# Altium schematic sheet 03_Power_Analog_Part.SchDoc
size A3; SheetNumber: 3; SheetTotal: 6
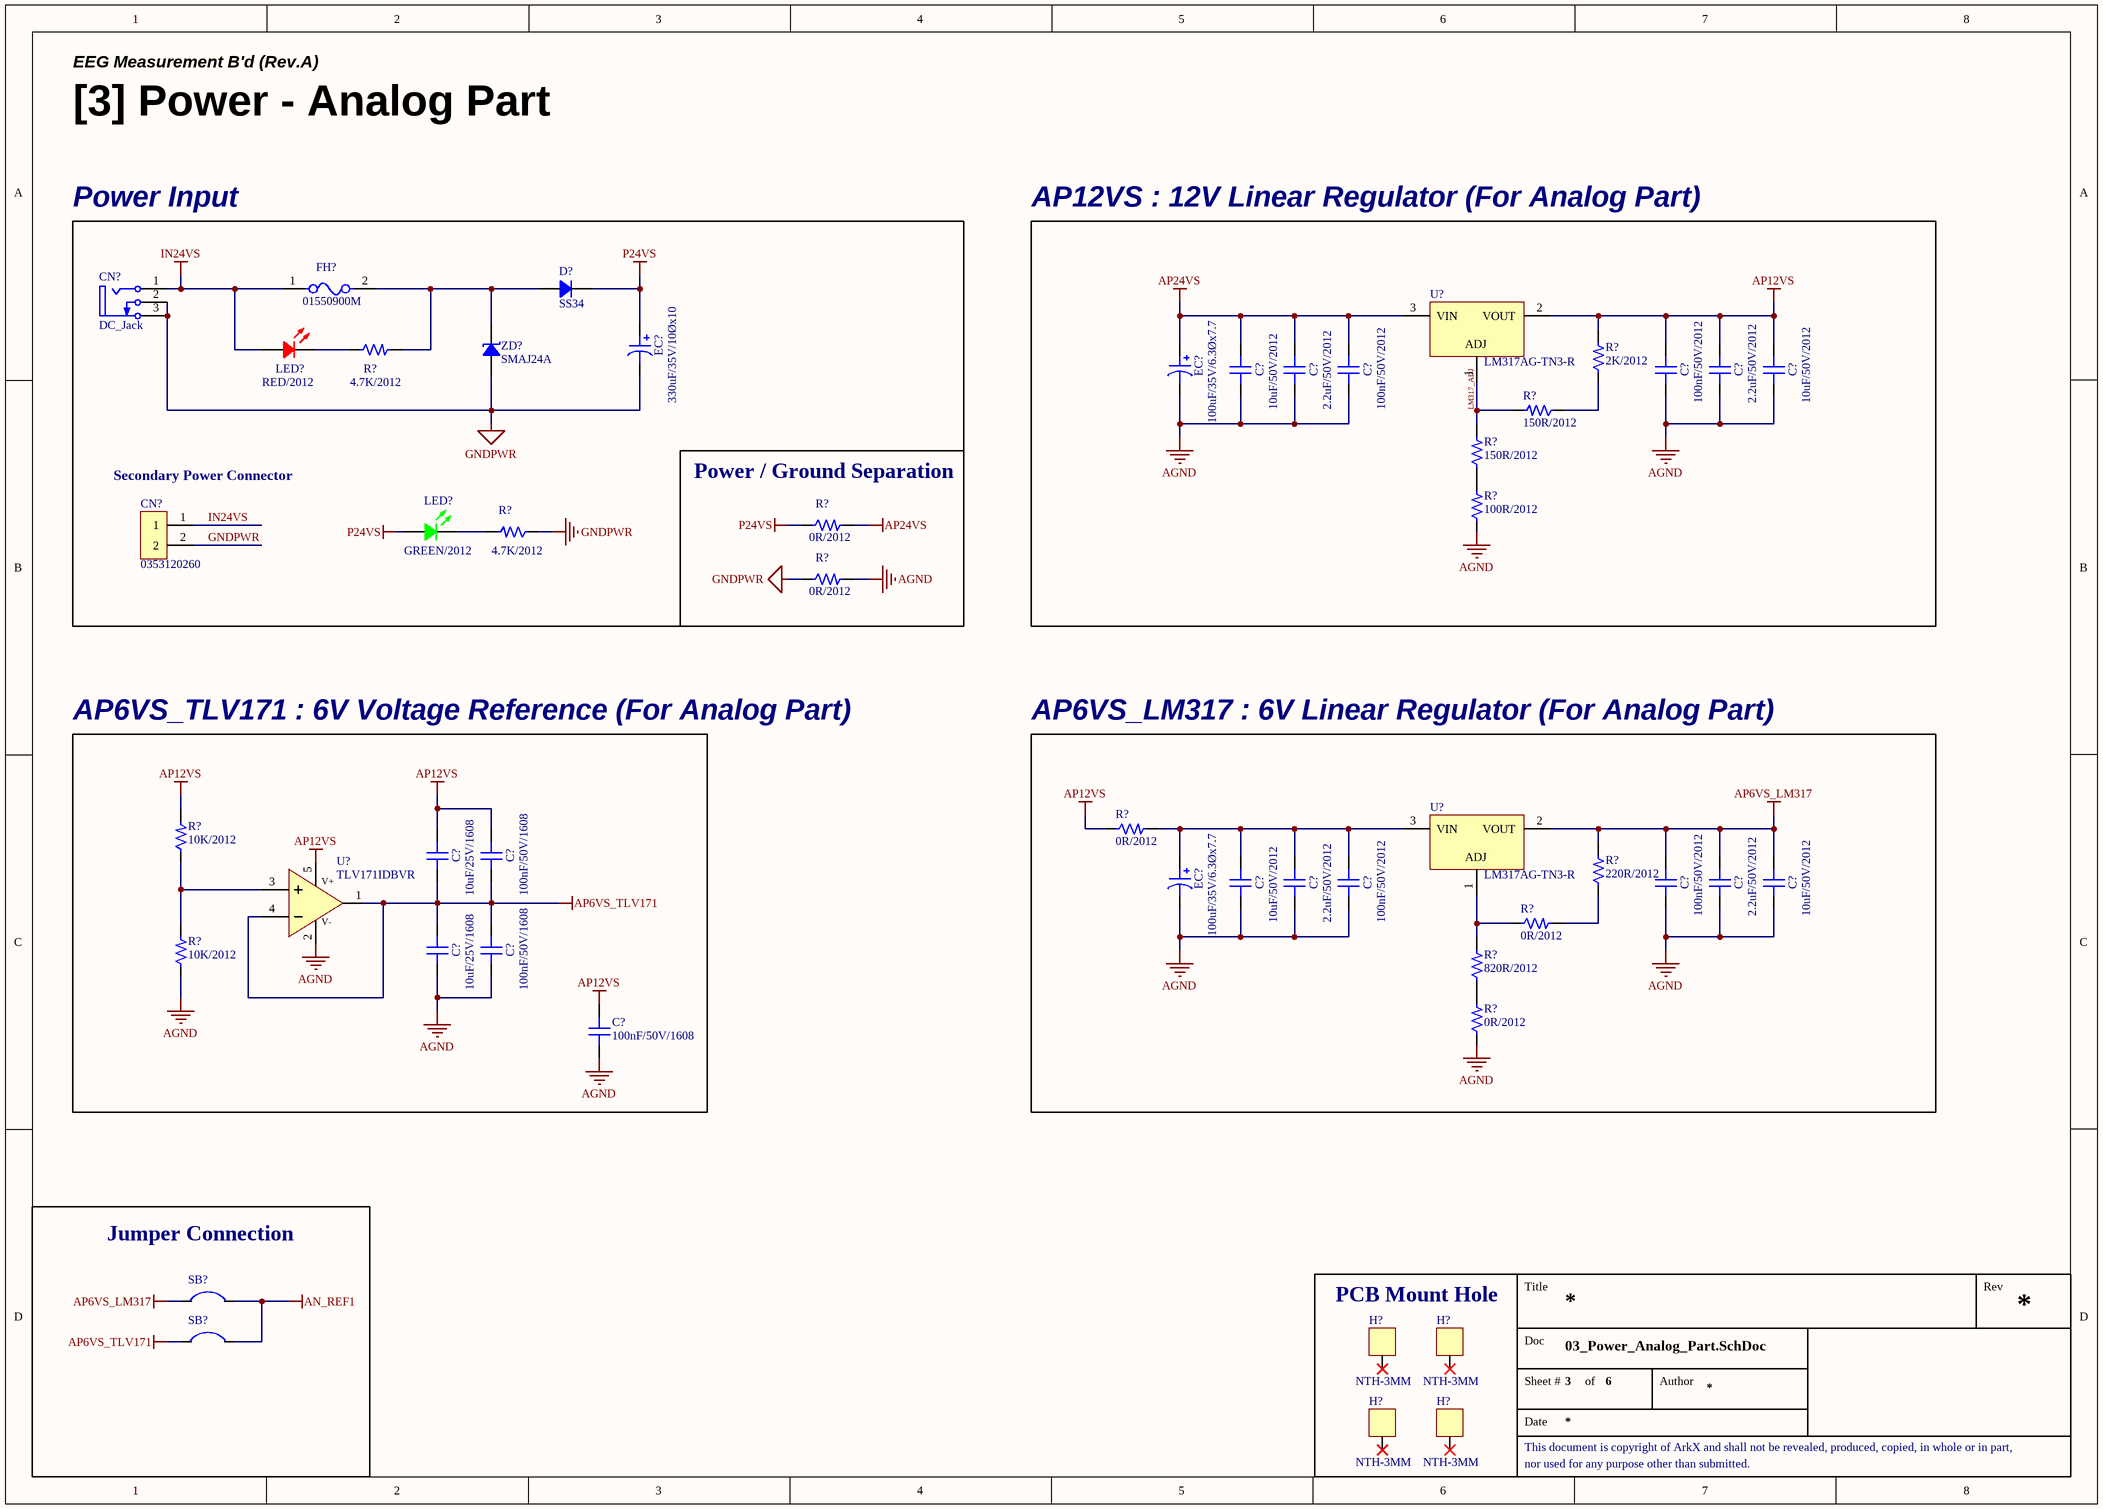
[diagram p0: 03_Power_Analog_Part.SchDoc]

## Parts
(Parts that share a designator on the sheet are numbered #1, #2 ... from top to bottom, then left to right.)
C?#1  10uF/50V/2012  [CAP 2012 (0805_INCH)]
C?#2  2.2uF/50V/2012  [CAP 2012 (0805_INCH)]
C?#3  100nF/50V/2012  [CAP 2012 (0805_INCH)]
C?#4  100nF/50V/2012  [CAP 2012 (0805_INCH)]
C?#5  2.2uF/50V/2012  [CAP 2012 (0805_INCH)]
C?#6  10uF/50V/2012  [CAP 2012 (0805_INCH)]
C?#7  10uF/25V/1608  [CAP 1608 (0603_INCH)]
C?#8  100nF/50V/1608  [CAP 1608 (0603_INCH)]
C?#9  10uF/50V/2012  [CAP 2012 (0805_INCH)]
C?#10  2.2uF/50V/2012  [CAP 2012 (0805_INCH)]
C?#11  100nF/50V/2012  [CAP 2012 (0805_INCH)]
C?#12  100nF/50V/2012  [CAP 2012 (0805_INCH)]
C?#13  2.2uF/50V/2012  [CAP 2012 (0805_INCH)]
C?#14  10uF/50V/2012  [CAP 2012 (0805_INCH)]
C?#15  10uF/25V/1608  [CAP 1608 (0603_INCH)]
C?#16  100nF/50V/1608  [CAP 1608 (0603_INCH)]
C?#17  100nF/50V/1608  [CAP 1608 (0603_INCH)]
CN?#1  DC_Jack  [CON DC-Jack]
CN?#2  0353120260  [CON 0353120260 (MOLEX)]
D?  SS34  [DIO DO-214AC (SMA)]
EC?#1  330uF/35V/10Øx10  [CAP ALSMD 10.3MM H10.5MM LEADSPANMAX12MM]
EC?#2  100uF/35V/6.3Øx7.7  [CAP ALSMD 6.6MM H7.7MM]
EC?#3  100uF/35V/6.3Øx7.7  [CAP ALSMD 6.6MM H7.7MM]
FH?  01550900M  [FUSE 01550900M_SMD(Hand_Solder)]
H?#1  NTH-3MM  [HOLE NTH-3MM]
H?#2  NTH-3MM  [HOLE NTH-3MM]
H?#3  NTH-3MM  [HOLE NTH-3MM]
H?#4  NTH-3MM  [HOLE NTH-3MM]
LED?#1  RED/2012  [LED MHT170RGBCT (RED)]
LED?#2  GREEN/2012  [LED MHT170RGBCT (GREEN)]
R?#1  4.7K/2012  [RES 2012 (0805_inch)]
R?#2  2K/2012  [RES 2012 (0805_inch)]
R?#3  150R/2012  [RES 2012 (0805_inch)]
R?#4  150R/2012  [RES 2012 (0805_inch)]
R?#5  100R/2012  [RES 2012 (0805_inch)]
R?#6  0R/2012  [RES 2012 (0805_inch)]
R?#7  4.7K/2012  [RES 2012 (0805_inch)]
R?#8  0R/2012  [RES 2012 (0805_inch)]
R?#9  0R/2012  [RES 2012 (0805_inch)]
R?#10  10K/2012  [RES 2012 (0805_inch)]
R?#11  220R/2012  [RES 2012 (0805_inch)]
R?#12  0R/2012  [RES 2012 (0805_inch)]
R?#13  10K/2012  [RES 2012 (0805_inch)]
R?#14  820R/2012  [RES 2012 (0805_inch)]
R?#15  0R/2012  [RES 2012 (0805_inch)]
SB?#1  SB  [SB (Solder-Bridge)]  (value not drawn)
SB?#2  SB  [SB (Solder-Bridge)]  (value not drawn)
U?#1  LM317AG-TN3-R
U?#2  LM317AG-TN3-R
U?#3  TLV171IDBVR  [SOT-23-5 (TI DBV PACKAGE)]
ZD?  SMAJ24A  [DIO DO-214AC (SMA)]

## Blocks framed on the sheet
Power Input: CN?#1 CN?#2 D? EC?#1 FH? LED?#1 LED?#2 R?#1 R?#7 ZD?
AP12VS : 12V Linear Regulator (For Analog Part): C?#1-C?#6 EC?#2 R?#2-R?#5 U?#1
Power / Ground Separation: R?#6 R?#8
AP6VS_TLV171 : 6V Voltage Reference (For Analog Part): C?#7 C?#8 C?#15-C?#17 R?#10 R?#13 U?#3
AP6VS_LM317 : 6V Linear Regulator (For Analog Part): C?#9-C?#14 EC?#3 R?#9 R?#11 R?#12 R?#14 R?#15 U?#2
Jumper Connection: SB?#1 SB?#2
PCB Mount Hole: H?#1-H?#4

## Nets
AGND: C?#1.1 C?#2.1 C?#3.1 C?#4.1 C?#5.1 C?#6.1 C?#9.1 C?#10.1 C?#11.1 C?#12.1 C?#13.1 C?#14.1 C?#15.1 C?#16.1 C?#17.1 EC?#2.2 EC?#3.2 R?#5.1 R?#8.2 R?#13.1 R?#15.1 U?#3.2(V-)
AN_REF1: SB?#1.1 SB?#2.1
AP6VS_LM317: C?#12.2 C?#13.2 C?#14.2 R?#11.2 SB?#1.2 U?#2.2(VOUT)
AP6VS_TLV171: C?#7.1 C?#8.1 C?#15.2 C?#16.2 SB?#2.2 U?#3.1(OUT) U?#3.4(IN-)
AP12VS: C?#4.2 C?#5.2 C?#6.2 C?#7.2 C?#8.2 C?#17.2 R?#2.2 R?#9.1 R?#10.2 U?#1.2(VOUT) U?#3.5(V+)
AP24VS: C?#1.2 C?#2.2 C?#3.2 EC?#2.1 R?#6.2 U?#1.3(VIN)
GNDPWR: CN?#1.2(GND) CN?#1.3(GND) CN?#2.2 EC?#1.2 R?#7.1 R?#8.1 ZD?.1
IN24VS: CN?#1.1(VCC) CN?#2.1 FH?.1 LED?#1.4(Common_Anode)
P24VS: D?.2 EC?#1.1 LED?#2.4(Common_Anode) R?#6.1
LM317_ADJ: R?#3.2 R?#4.2 U?#1.1(ADJ)
NetC?#9_2: C?#9.2 C?#10.2 C?#11.2 EC?#3.1 R?#9.2 U?#2.3(VIN)
NetD?_1: D?.1 FH?.2 R?#1.2 ZD?.2
NetLED?#1_1: LED?#1.1(RED) R?#1.1
NetLED?#2_2: LED?#2.2(GREEN) R?#7.2
NetR?#2_1: R?#2.1 R?#3.1
NetR?#4_1: R?#4.1 R?#5.2
NetR?#10_1: R?#10.1 R?#13.2 U?#3.3(IN+)
NetR?#11_1: R?#11.1 R?#12.2
NetR?#12_1: R?#12.1 R?#14.2 U?#2.1(ADJ)
NetR?#14_1: R?#14.1 R?#15.2

Not connected (* = marked no-connect by the designer): H?#1 1*; H?#2 1*; H?#3 1*; H?#4 1*

## Notes on the sheet
- EEG Measurement B'd (Rev.A)
- [3] Power - Analog Part
- (near CN?#2) Secondary Power Connector
- Title
- Rev
- Doc
- Sheet #
- of
- Author
- This document is copyright of ArkX and shall not be revealed, produced, copied, in whole or in part,
- Date
- nor used for any purpose other than submitted.

## Library data of the parts
C?#1 C?#6 C?#9 C?#14 = CAP_10uF/50V/2012: Ceramic CAP_10uF/50V/2012; LCSC Part #: C440198; JLCPCB Part Type: Basic Part
C?#2 C?#5 C?#10 C?#13 = CAP_2.2uF/50V/2012: Ceramic CAP_2.2uF/50V/2012; LCSC Part #: C49217; JLCPCB Part Type: Basic Part
C?#3 C?#4 C?#11 C?#12 = CAP_100nF/50V/2012: Ceramic CAP_100nF/50V/2012; LCSC Part #: C49678; JLCPCB Part Type: Basic Part
C?#7 C?#15 = CAP_10uF/25V/1608: Ceramic CAP_10uF/25V/1608; LCSC Part #: C96446; JLCPCB Part Type: Basic Part
C?#8 C?#16 C?#17 = CAP_100nF/50V/1608: Ceramic CAP_100nF/50V/1608; LCSC Part #: C14663; JLCPCB Part Type: Basic Part
CN?#1 = CON_DC-Jack: ComponentLink1Description: Manufacturer Link; ComponentLink1URL: http://www.cliffuk.co.uk/
CN?#2 = CON_0353120260: CONN HEADER VERT 2POS 2.5MM
D? = DIO_SS34: DIODE SCHOTTKY 40V 3A SMC; LCSC Part #: C8678; JLCPCB Part Type: Basic Part
EC?#1 = CAP_EC 330uF/35V/10Øx10: Electrolytic CAP_330uF/35V/10Øx10; LCSC Part #: C311621; JLCPCB Part Type: Extended Part
EC?#2 EC?#3 = CAP_EC 100uF/35V/6.3Øx7.7: Eletrolytic CAP_100uF/35V/6.3Øx7.7; LCSC Part #: C176666; JLCPCB Part Type: Extended Part
FH? = FUSE_01550900M-SMD: Fuse Block 10A 125V 1 Circuit Cartridge Surface Mount; LCSC Part #: C108518; JLCPCB Part Type: Extended Part
H?#1-H?#4 = HOLE_NTH-3MM: Non-Through Hole 3mm
LED?#1 = LED_MHT170RGBCT(RED): Colorless transparence -30℃~+85℃ Positive post Common anode RGB 120° 0805  Light Emitting Diodes (LED) ROHS; LCSC Part #: C2962094; JLCPCB Part Type: Extended Part
LED?#2 = LED_MHT170RGBCT(GREEN): Colorless transparence -30℃~+85℃ Positive post Common anode RGB 120° 0805  Light Emitting Diodes (LED) ROHS; LCSC Part #: C2962094; JLCPCB Part Type: Extended Part
R?#1 R?#7 = RES_4.7K/2012/0.125W: Value: 4.7K; Power Rating: 0.125W; Precision: 1%; Size: 2012; LCSC Part #: C17673; JLCPCB Part Type: Basic Part
R?#2 = RES_2K/2012/0.125W: Value: 2K; Power Rating: 0.125W; Precision: 1%; Size: 2012; LCSC Part #: C17604; JLCPCB Part Type: Basic Part
R?#3 R?#4 = RES_150R/2012/0.125W: Value: 150R; Power Rating: 0.1W; Precision: 1%; Size: 1608; LCSC Part #: C17471; JLCPCB Part Type: Basic Part
R?#5 = RES_100R/2012/0.125W: Value: 100R; Power Rating: 0.125W; Precision: 1%; Size: 2012; LCSC Part #: C17408; JLCPCB Part Type: Basic Part
R?#6 R?#8 R?#9 R?#12 R?#15 = RES_0R/2012/0.125W: Value: 0R; Power Rating: 0.1W; Precision: 1%; Size: 1608; LCSC Part #: C17477; JLCPCB Part Type: Basic Part
R?#10 R?#13 = RES_10K/2012/0.125W: Value: 10K; Power Rating: 0.125W; Precision: 1%; Size: 2012; LCSC Part #: C17414; JLCPCB Part Type: Basic Part
R?#11 = RES_220R/2012/0.125W: Value: 220R; Power Rating: 0.125W; Precision: 1%; Size: 2012; LCSC Part #: C17557; JLCPCB Part Type: Basic Part
R?#14 = RES_820R/2012/0.125W: Value: 820R; Power Rating: 0.125W; Precision: 1%; Size: 2012; LCSC Part #: C17837; JLCPCB Part Type: Basic Part
SB?#1 SB?#2 = SB_Solder-Bridge
U?#1 U?#2 = IC_REG_LM317AG-TN3-R: 1.5A 5V@(500mA) Adjustable 1.2V~37V Positive 1 40V TO-252-2(DPAK)  Linear Voltage Regulators (LDO) ROHS; LCSC Part #: C75510; JLCPCB Part Type: Basic Part
U?#3 = IC_OPAMP_TLV171IDBVR: Single, 36-V, 3-MHz, low-power operational amplifier for cost-sensitive applications; LCSC Part #: C2864299; JLCPCB Part Type: Extended Part
ZD? = DIO_SMAJ24A: Rectifier Diode; LCSC Part #: C113962; JLCPCB Part Type: Extended Part